# EAGLE design TSAL_2016 (EAGLE 7.5.0)
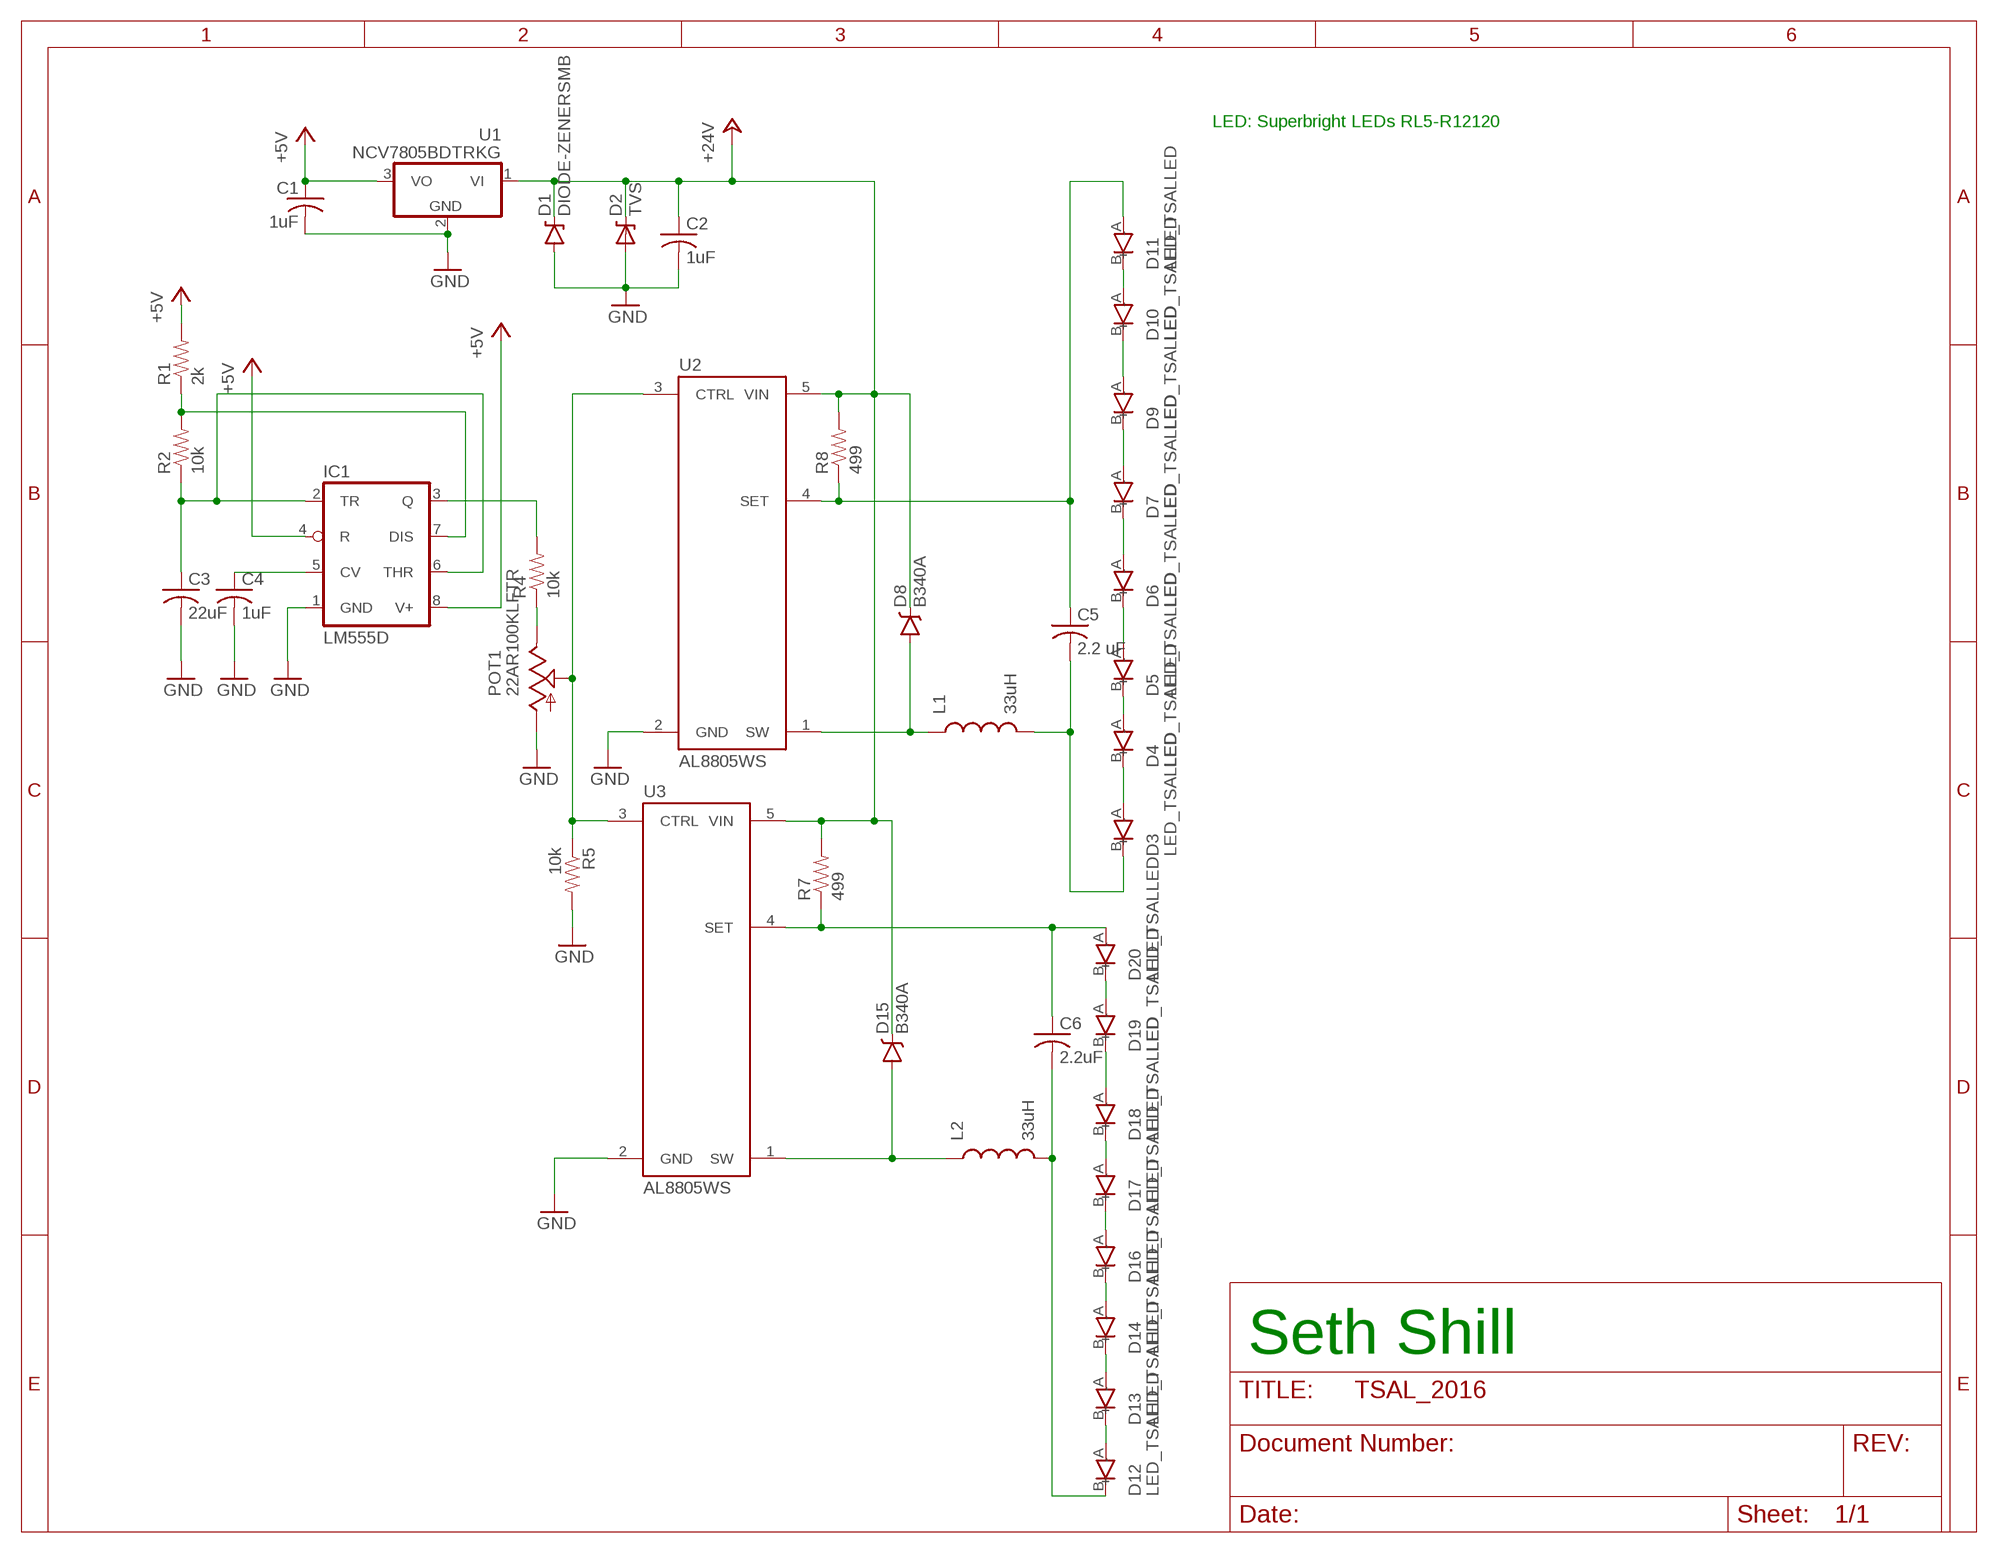
[diagram p0: schematic, sheet 1]

## Parts
C1  1uF  CAP_1UF_50V_0805  [0805@1]
C2  1uF  CAP_1UF_50V_0805  [0805@1]
C3  22uF  CAP_22UF_6.3V_0805  [0805@1]
C4  1uF  CAP_1UF_50V_0805  [0805@1]
C5  2.2 uF  CAP_2.2UF_16V_0603  [0603@1]
C6  2.2uF  CAP_2.2UF_16V_0603  [0603@1]
D1  DIODE-ZENERSMB  [SMB-DIODE]
D2  TVS  [DO-214AC]
D3  LED_TSALLED  [LED_TSAL]
D4  LED_TSALLED  [LED_TSAL]
D5  LED_TSALLED  [LED_TSAL]
D6  LED_TSALLED  [LED_TSAL]
D7  LED_TSALLED  [LED_TSAL]
D8  B340A  DIODE-SCHOTTKY-B340A  [SMA-DIODE]
D9  LED_TSALLED  [LED_TSAL]
D10  LED_TSALLED  [LED_TSAL]
D11  LED_TSALLED  [LED_TSAL]
D12  LED_TSALLED  [LED_TSAL]
D13  LED_TSALLED  [LED_TSAL]
D14  LED_TSALLED  [LED_TSAL]
D15  B340A  DIODE-SCHOTTKY-B340A  [SMA-DIODE]
D16  LED_TSALLED  [LED_TSAL]
D17  LED_TSALLED  [LED_TSAL]
D18  LED_TSALLED  [LED_TSAL]
D19  LED_TSALLED  [LED_TSAL]
D20  LED_TSALLED  [LED_TSAL]
IC1  LM555D  [SO08]
L1  33uH  INDUCTOR1007  [1007]
L2  33uH  INDUCTOR1007  [1007]
POT1  22AR100KLFTR  [22AR100KLFTR]
R1  2k  RES_2K_1%_0805  [0805@1]
R2  10k  RES_10K_1%_0805  [0805@1]
R4  10k  RES_10K_1%_0805  [0805@1]
R5  10k  RES_10K_1%_0805  [0805@1]
R7  499  RES_499_1%  [0603@1]
R8  499  RES_499_1%  [0603@1]
U1  NCV7805BDTRKG  [DPAK]
U2  AL8805WS  AL8805  [SOT23-5]
U3  AL8805WS  AL8805  [SOT23-5]

## Nets
+5V: C1.1(+) IC1.4(R) IC1.8(V+) R1.2 U1.3(VO)
+24V: C2.1(+) D1.C D2.C D8.C D15.C R7.2 R8.2 U1.1(VI) U2.5(VIN) U3.5(VIN)
GND: C1.2(-) C2.2(-) C3.2(-) C4.2(-) D1.A D2.A IC1.1(GND) POT1.3(CW) R5.2 U1.2(GND) U2.2(GND) U3.2(GND)
N$1: C6.1(+) D20.A(+) R7.1 U3.4(SET)
N$2: POT1.2(W) R5.1 U2.3(CTRL) U3.3(CTRL)
N$3: D17.A(+) D18.B(-)
N$4: C4.1(+) IC1.5(CV)
N$5: IC1.7(DIS) R1.1 R2.2
N$7: D15.A L2.1 U3.1(SW)
N$8: C5.1(+) D11.A(+) R8.1 U2.4(SET)
N$9: D10.A(+) D11.B(-)
N$10: C3.1(+) IC1.2(TR) IC1.6(THR) R2.1
N$11: D18.A(+) D19.B(-)
N$12: D9.A(+) D10.B(-)
N$13: D7.A(+) D9.B(-)
N$14: C6.2(-) D12.B(-) L2.2
N$15: D6.A(+) D7.B(-)
N$16: D5.A(+) D6.B(-)
N$17: D19.A(+) D20.B(-)
N$18: D12.A(+) D13.B(-)
N$19: C5.2(-) D3.B(-) L1.2
N$20: D13.A(+) D14.B(-)
N$21: D16.A(+) D17.B(-)
N$22: D14.A(+) D16.B(-)
N$23: D4.A(+) D5.B(-)
N$24: D3.A(+) D4.B(-)
N$26: D8.A L1.1 U2.1(SW)
N$27: POT1.1(CCW) R4.1
N$28: IC1.3(Q) R4.2

## Notes on the sheet
- LED: Superbright LEDs RL5-R12120
- Seth Shill

## Library data of the parts
C1 C2 C4 = FSAE Electric:CAP; PARTNO: UMK212F105ZG-T
C3 = FSAE Electric:CAP; PARTNO: CL21A226MQCLQNC
C5 C6 = FSAE Electric:CAP; PARTNO: EMK107F225ZA-T
D1 = FSAE Electric:DIODE-ZENER: Zener Diode Production Part - 8199 3.4V Zener Voltage
D2 = FSAE Electric:TVS: Diode
D3-D7 D9-D14 D16-D20 = FSAE Electric:LED_TSAL
D8 D15 = FSAE Electric:DIODE-SCHOTTKY: Schottky diodes in SFE's production catalog BAT20J 1A 23V 0.62Vf RB751 120mA 40V 0.37Vf PMEG4005EJ 0.5A 40V 0.42Vf MBRA140 1A 40V 0.5Vf B340A 3A 40V SMA; PROD_ID: DIO-09886
IC1 = FSAE Electric:*555: TIMER
L1 L2 = FSAE Electric:INDUCTOR: Inductors Basic Inductor/Choke - 0603 and 1206. Footprints are not proven and vary greatly between part numbers. INDUCTOR POWER 3.3UH 4.0A SMD 0.197" L x 0.197" W x 0.177" H (5.00mm x 5.00mm x 4.50mm); PARTNO: CB2518T330K
POT1 = FSAE Electric:22AR100KLFTR; PARTNO: 22AR100KLFTR
R1 = FSAE Electric:RES: Resistors; PARTNO: RC0805FR-072KL
R2 R4 R5 = FSAE Electric:RES: Resistors; PARTNO: RC0805FR-0710KL
R7 R8 = FSAE Electric:RES: Resistors; PARTNO: RC0603FR-07499RL
U1 = FSAE Electric:NCV7805BDTRKG; PARTNO: NCV7805BDTRKG
U2 U3 = FSAE Electric:AL8805: Constant current LED driver PWM-able 1MHz switch freq 6V-36V Up to 1A LED current; PROD_ID: IC-11626

## Board
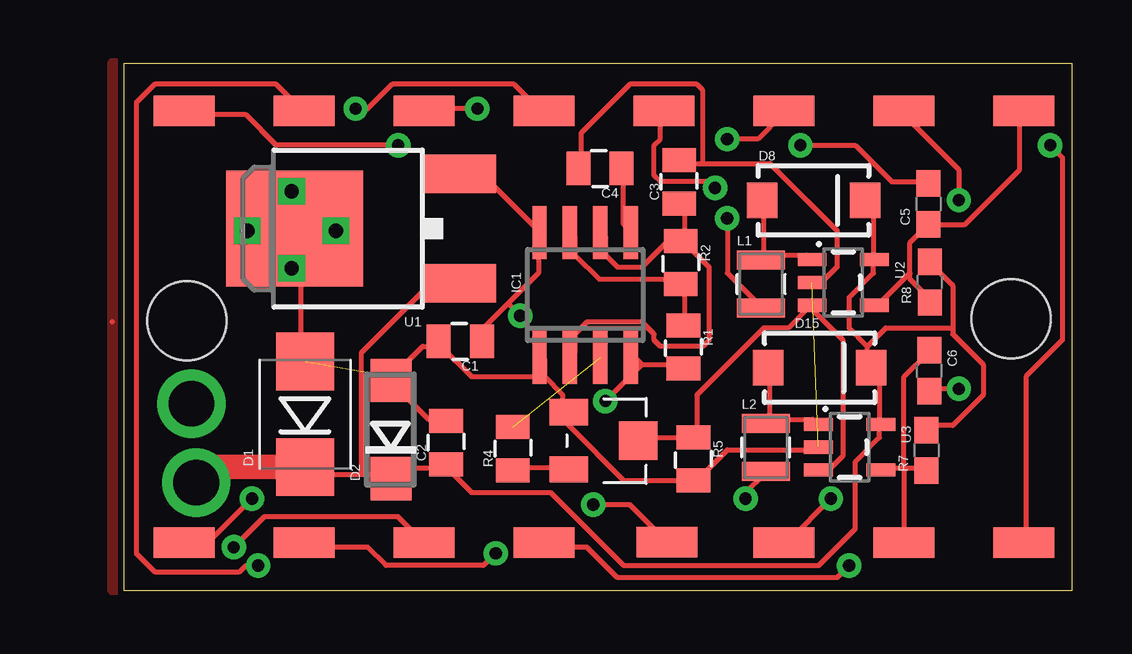
[diagram p1: board, top side]
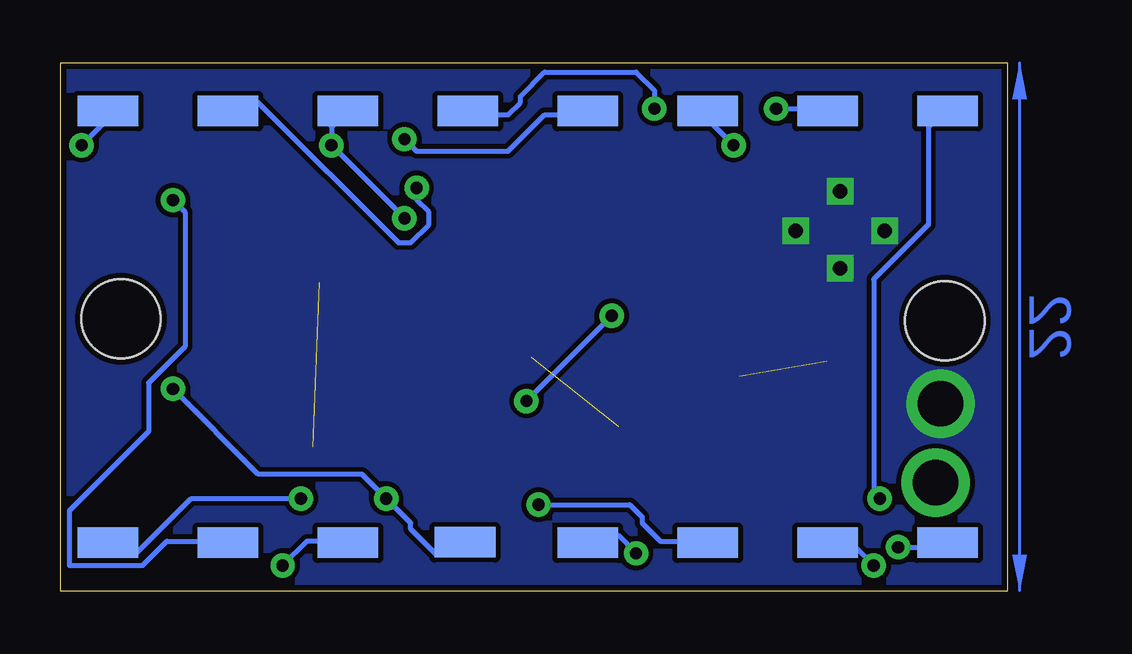
[diagram p2: board, bottom side, seen from below]

Size 39.5 x 22 mm. Coordinates in mm from the lower left corner, seen from the top.
Outline: 0,0 0,22 39.5,22 39.5,0 0,0
Copper layers (1*16): Top 0.035mm / dielectric 1.5mm / Bottom 0.035mm
Design rules "SparkFun": minimum track width 8mil, minimum drill 20mil, track to track 8mil, track to pad 8mil, pad to pad 8mil, via to via 8mil, smd to smd 8mil, copper to edge 10mil, drill to drill 8mil, minimum pad ring 12mil, minimum via ring 10mil, stop-mask expansion 4mil, vias tented up to drill 25mil, thermal gap 10mil
Holes 3.3 mm at 2.62,11.25 36.97,11.34

### Footprints (pad centres in the part's own frame; a part is rotated, then mirrored left to right if it is on the bottom)
0805@1 = smd 1 x 1.4: 1 -0.9,0; 2 0.9,0
0603@1 = smd 1.1 x 1: 1 -0.85,0; 2 0.85,0
SMB-DIODE = smd 2.4 x 2.4: A 2.2,0; C -2.2,0
DO-214AC = smd 1.8 x 1.7: A 2.05,0; C -2.05,0
LED_TSAL = smd 2.54 x 1.27: A 0,0 | smd 2.54 x 1.27 bottom: B 0,0
SMA-DIODE = smd 1.27 x 1.47: A -2.15,0; C 2.15,0
SO08 = smd 0.6 x 2.2: 1 -1.905,-2.6; 2 -0.635,-2.6; 3 0.635,-2.6; 4 1.905,-2.6; 5 1.905,2.6; 6 0.635,2.6; 7 -0.635,2.6; 8 -1.905,2.6
1007 = smd 2 x 0.8: 1 0,1; 2 0,-1
22AR100KLFTR = smd 1.092 x 1.6: 1 1.194,-1.448; 3 -1.194,-1.448 | smd 1.6 x 1.6: 2 0,1.448
DPAK = smd 1.6 x 3: 1 -2.28,-4.04; 3 2.28,-4.04 | smd 4.826 x 5.715: 2 0,2.858
SOT23-5 = smd 0.55 x 1.2: 1 -0.95,-1.3; 2 0,-1.3; 3 0.95,-1.3; 4 0.95,1.3; 5 -0.95,1.3

### Placement (x,y rotation side)
C1  14.01,10.4 180 top
C2  13.41,6.17 90 top
C3  23.13,17.05 90 top
C4  19.84,17.61 180 top
C5  33.52,16.13 90 top
C6  33.55,9.17 270 top
D1  7.54,7.36 90 top
D2  11.12,6.72 90 top
D3  27.5,20 0 top
D4  17.5,20 0 top
D5  7.5,20 0 top
D6  7.5,2 0 top
D7  17.5,2 0 top
D8  28.73,16.28 0 top
D9  27.5,2 0 top
D10  37.5,2 0 top
D11  37.5,20 0 top
D12  22.62,2.02 0 top
D13  12.5,2 0 top
D14  2.5,2 0 top
D15  28.99,9.29 0 top
D16  2.5,20 0 top
D17  12.5,20 0 top
D18  22.5,20 0 top
D19  32.5,20 0 top
D20  32.5,2 0 top
IC1  19.21,12.33 0 top
L1  26.54,12.79 0 top
L2  26.74,5.97 0 top
POT1  19.98,6.25 270 top
R1  23.31,10.16 270 top
R2  23.2,13.69 270 top
R4  16.2,5.92 90 top
R5  23.73,5.5 270 top
R7  33.45,5.85 90 top
R8  33.58,12.86 90 top
U1  9.96,15.1 90 top
U2  29.98,12.85 270 top
U3  30.24,5.99 270 top

### Tracks (layer width: path | path; a pad name or v marks a point on that pad's centre or on a via)
+5V  (via drill 0.51)
  Top 0.203: 21.58,9.43 23.11,9.43 R1.2 | 21.58,9.43 21.33,9.68 IC1.4 | 15.99,11.97 17.26,13.24 17.26,14.76 IC1.8 17.26,15.02 14.98,17.3 14.22,17.3 U1.3 | 15.99,11.97 14.98,10.95 14.98,10.45 C1.1 | v20.06,7.91 21.58,9.43 | 15.99,11.97 v16.5,11.46
  Bottom 0.203: v16.5,11.46 v20.06,7.91
+24V  (via drill 1.9)
  Top 0.203: 34.54,10.95 34.54,12.73 33.77,13.49 R8.2 | 34.54,10.95 34.54,10.7 35.81,9.43 35.81,8.16 34.54,6.89 33.52,6.89 R7.2 | D8.C 30.98,16.03 31.23,15.78 31.23,14 U2.5 31.23,13.75 31.23,13.24 30.22,12.22 30.22,10.95 30.98,10.19 | 30.98,10.19 30.98,9.43 D15.C 31.23,9.18 31.49,8.92 31.49,7.14 U3.5 31.49,6.89 31.49,6.38 30.47,5.37 30.47,2.57 28.95,1.05 20.82,1.05 17.77,4.1 14.47,4.1 13.45,5.11 C2.1 13.2,5.11 11.42,5.11 11.17,4.86 D2.C 10.91,4.86 9.9,4.86 | 34.54,10.95 31.74,10.95 30.98,10.19 | 9.9,4.86 7.87,4.86 D1.C | 9.9,4.86 9.9,9.94 12.69,12.73 13.96,12.73 U1.1
  Top 0.406: D8.C 31,16.28 31,16
  Top 1.016: v3,4.5 3.65,5.16 D1.C
GND  (via drill 0.6, 1.9)  (2 unrouted)
  Top 0.203: 24.12,17.81 23.36,17.81 C3.2 | 24.12,17.81 26.92,17.81 29.71,15.02 29.71,13.49 29.2,12.99 28.69,12.99 U2.2 | 24.12,17.81 24.12,20.86 23.87,21.11 21.07,21.11 19.04,19.08 19.04,17.81 C4.2 | 7.1,13.24 7.36,12.99 7.36,9.68 D1.A | 7.1,13.24 U1.2 | 7.1,13.24 v6.98,13.45 | U3.2 28.69,5.87 25.14,5.87 23.87,4.6 R5.2 23.61,4.6 20.82,4.6 18.53,6.89 18.53,7.4 POT1.3 18.28,7.65 18.28,8.16 17.52,8.92 | 17.52,8.92 17.52,9.68 IC1.1 17.52,8.92 | C2.2 13.2,7.14 12.69,7.14 11.17,8.67 D2.A 11.17,8.92 12.44,10.19 12.95,10.19 C1.2 13.2,10.19 14.47,8.92 17.52,8.92
  other vias: 2.8,7.8 5.13,15 6.98,16.65 8.83,15
  pour Bottom: -0.5,22 -0.5,0 40.5,0 40.5,22
  pour Bottom: -0.5,22 -0.5,0 40.5,0 40.5,22
N$1
  Top 0.203: 32.5,5.11 31.74,5.11 U3.4 | 32.5,5.11 33.27,5.11 R7.1 | 32.5,5.11 32.5,8.92 33.52,9.94 C6.1 | 32.5,5.11 32.5,2.06 D20.A
  Top 0.406: R7.1 33.41,5.04
N$2
  Top 0.203: POT1.2 21.58,6.38 23.61,6.38 R5.1 23.87,6.64 23.87,8.16 26.66,10.95 27.68,10.95 28.44,11.72 U2.3 28.69,11.72 29.96,10.45 29.96,5.62 29.46,5.11 28.95,5.11 U3.3
N$3  (via drill 0.51)
  Top 0.203: v14.72,20.1 12.69,20.1 D17.A
  Bottom 0.203: v14.72,20.1 14.72,20.86 15.49,21.62 19.3,21.62 20.31,20.61 20.31,20.35 20.82,19.84 22.34,19.84 D18.B
N$4
  Top 0.203: C4.1 20.82,17.56 20.82,15.27 21.07,15.02 IC1.5
N$5
  Top 0.203: R1.1 23.36,11.21 23.36,12.73 R2.2 23.11,12.99 19.8,12.99 18.79,14 18.79,14.76 IC1.7
N$7
  Top 0.203: 26.92,7.14 28.69,7.14 U3.1 | 26.92,7.14 26.92,9.18 D15.A | 26.92,7.14 L2.1
N$8
  Top 0.203: 32.76,13.24 32.76,12.99 33.52,12.22 R8.1 | 32.76,13.24 32.76,14.51 C5.1 33.77,15.27 35.04,15.27 37.33,17.56 37.33,19.84 D11.A | 32.76,13.24 31.49,11.97 U2.4
N$9  (via drill 0.51)
  Top 0.203: v38.6,18.57 39.11,18.07 39.11,10.45 37.58,8.92 37.58,2.06 D10.A
  Bottom 0.203: v38.6,18.57 37.33,19.84 D11.B
N$10
  Top 0.203: R2.1 23.36,14.76 23.36,16.03 C3.1 | R2.1 23.11,14.51 22.6,14.51 21.58,13.49 20.57,13.49 20.06,14 20.06,14.76 IC1.6 | IC1.2 18.79,9.94 18.79,10.7 19.3,11.21 21.58,11.21 22.09,10.7 22.09,10.45 22.34,10.19 24.12,10.19 24.38,10.45 24.38,13.49 23.36,14.51 R2.1
N$11  (via drill 0.51)
  Top 0.203: v24.63,16.8 24.38,17.05 22.34,17.05 22.09,17.3 22.09,18.57 22.34,18.83 22.34,19.84 D18.A
  Bottom 0.203: v24.63,16.8 24.63,16.29 24.12,15.78 24.12,15.27 24.88,14.51 25.39,14.51 31.23,20.35 32,20.35 32.25,20.1 D19.B
N$12  (via drill 0.51)
  Top 0.203: v29.46,3.84 27.68,2.06 D9.A
  Bottom 0.203: v29.46,3.84 34.03,3.84 36.31,1.56 37.08,1.56 37.33,1.81 D10.B
N$13  (via drill 0.51)
  Top 0.203: v30.22,1.05 29.71,0.54 20.57,0.54 19.3,1.81 17.52,1.81 D7.A
  Bottom 0.203: v30.22,1.05 29.2,2.06 27.68,2.06 D9.B
N$14  (via drill 0.51)
  Top 0.203: v34.79,8.41 33.77,8.41 C6.2 | v25.9,3.84 25.9,4.1 26.66,4.86 L2.2
  Bottom 0.203: v34.79,8.41 31.23,4.86 26.92,4.86 v25.9,3.84 24.88,2.83 24.88,2.57 23.87,1.56 23.11,1.56 22.85,1.81 D12.B
N$15  (via drill 0.51)
  Top 0.203: v15.49,1.56 14.98,1.05 10.91,1.05 10.15,1.81 7.61,1.81 D6.A
  Bottom 0.203: v15.49,1.56 16.25,2.32 17.01,2.32 17.26,2.06 D7.B
N$16  (via drill 0.51)
  Top 0.203: v5.58,1.05 5.07,1.05 4.82,0.79 1.26,0.79 0.5,1.56 0.5,20.35 1.26,21.11 6.34,21.11 7.36,20.1 D5.A
  Bottom 0.203: v5.58,1.05 6.34,1.81 7.36,1.81 D6.B
N$17  (via drill 0.51)
  Top 0.203: v34.79,16.29 34.79,17.56 32.5,19.84 D19.A
  Bottom 0.203: v34.79,16.29 34.28,15.78 34.28,10.19 35.81,8.67 35.81,6.64 39.11,3.33 39.11,1.05 36.06,1.05 35.04,2.06 32.5,2.06 D20.B
N$18  (via drill 0.51)
  Top 0.203: v19.55,3.59 21.07,3.59 22.6,2.06 D12.A
  Bottom 0.203: v19.55,3.59 15.74,3.59 15.23,3.08 15.23,2.83 14.47,2.06 12.69,2.06 D13.B
N$19  (via drill 0.51)
  Top 0.203: v28.19,18.57 30.47,18.57 32,17.05 33.52,17.05 C5.2 | v25.14,15.53 25.14,13.24 26.41,11.97 L1.2
  Bottom 0.203: D3.B 27.68,19.84 28.19,19.34 v28.19,18.57 v25.14,15.53
N$20  (via drill 0.51)
  Top 0.203: v4.56,1.81 5.83,3.08 11.42,3.08 12.44,2.06 D13.A
  Bottom 0.203: v4.56,1.81 2.53,1.81 D14.B
N$21  (via drill 0.51)
  Top 0.203: v11.42,18.57 6.34,18.57 5.07,19.84 2.53,19.84 D16.A
  Bottom 0.203: v11.42,18.57 12.69,19.84 D17.B
N$22  (via drill 0.51)
  Top 0.203: v5.33,3.84 3.55,2.06 2.53,2.06 D14.A
  Bottom 0.203: v5.33,3.84 5.58,4.1 5.58,12.99 3.29,15.27 3.29,19.34 2.53,20.1 D16.B
N$23  (via drill 0.51)
  Top 0.203: v9.64,20.1 10.15,20.1 11.17,21.11 16.25,21.11 17.26,20.1 D4.A
  Bottom 0.203: v9.64,20.1 7.61,20.1 D5.B
N$24  (via drill 0.51)
  Top 0.203: v25.14,18.83 26.41,18.83 27.42,19.84 D3.A
  Bottom 0.203: v25.14,18.83 24.63,18.32 20.82,18.32 19.3,19.84 17.52,19.84 D4.B
N$26
  Top 0.203: 26.66,14 28.44,14 U2.1 | 26.66,14 26.66,16.03 D8.A | 26.66,14 L1.1
N$27
  Top 0.203: R4.1 16.25,5.11 18.28,5.11 POT1.1
N$28  (1 unrouted)
N$32
  Top 0.203: -0.52,11.21 -0.5,11.21
  pour Top: -0.5,21 -0.5,0 40.5,0 40.5,22 -0.5,22
(copper drawn outside any net)
  shapes: Bottom area x1